# EAGLE design BEP2_rev1 seeed (EAGLE 6.5.0)
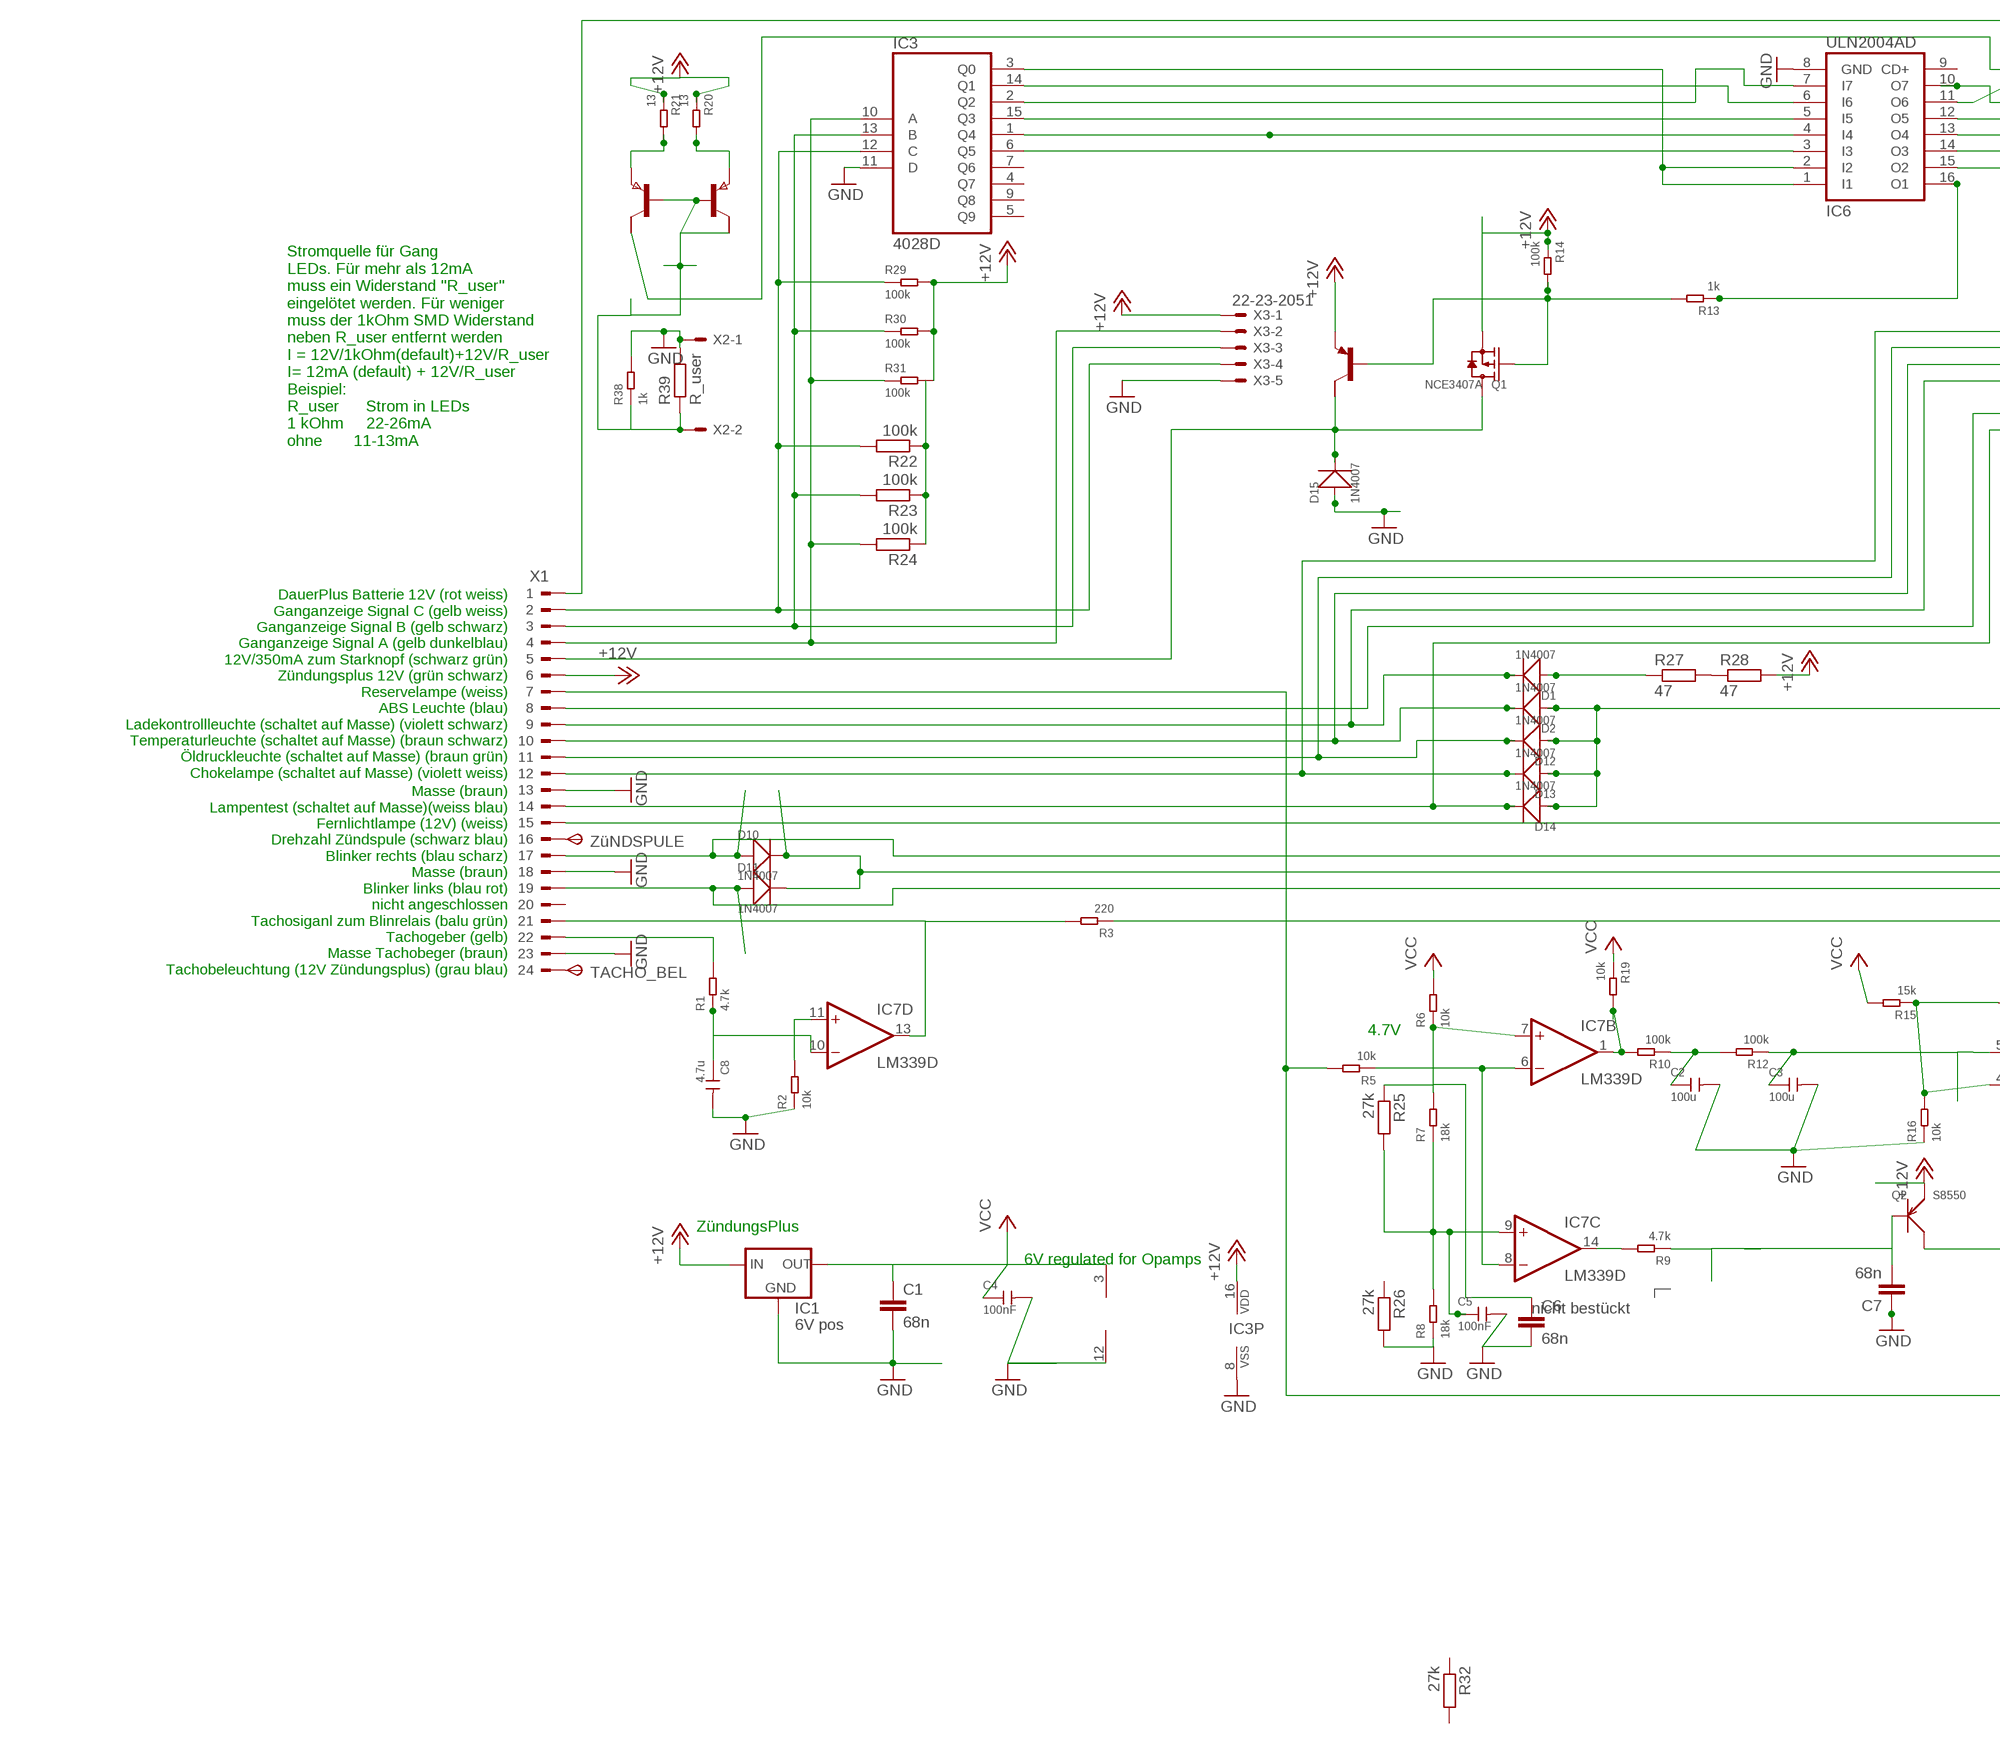
[diagram p0: schematic, sheet 1, part 1 of 2]
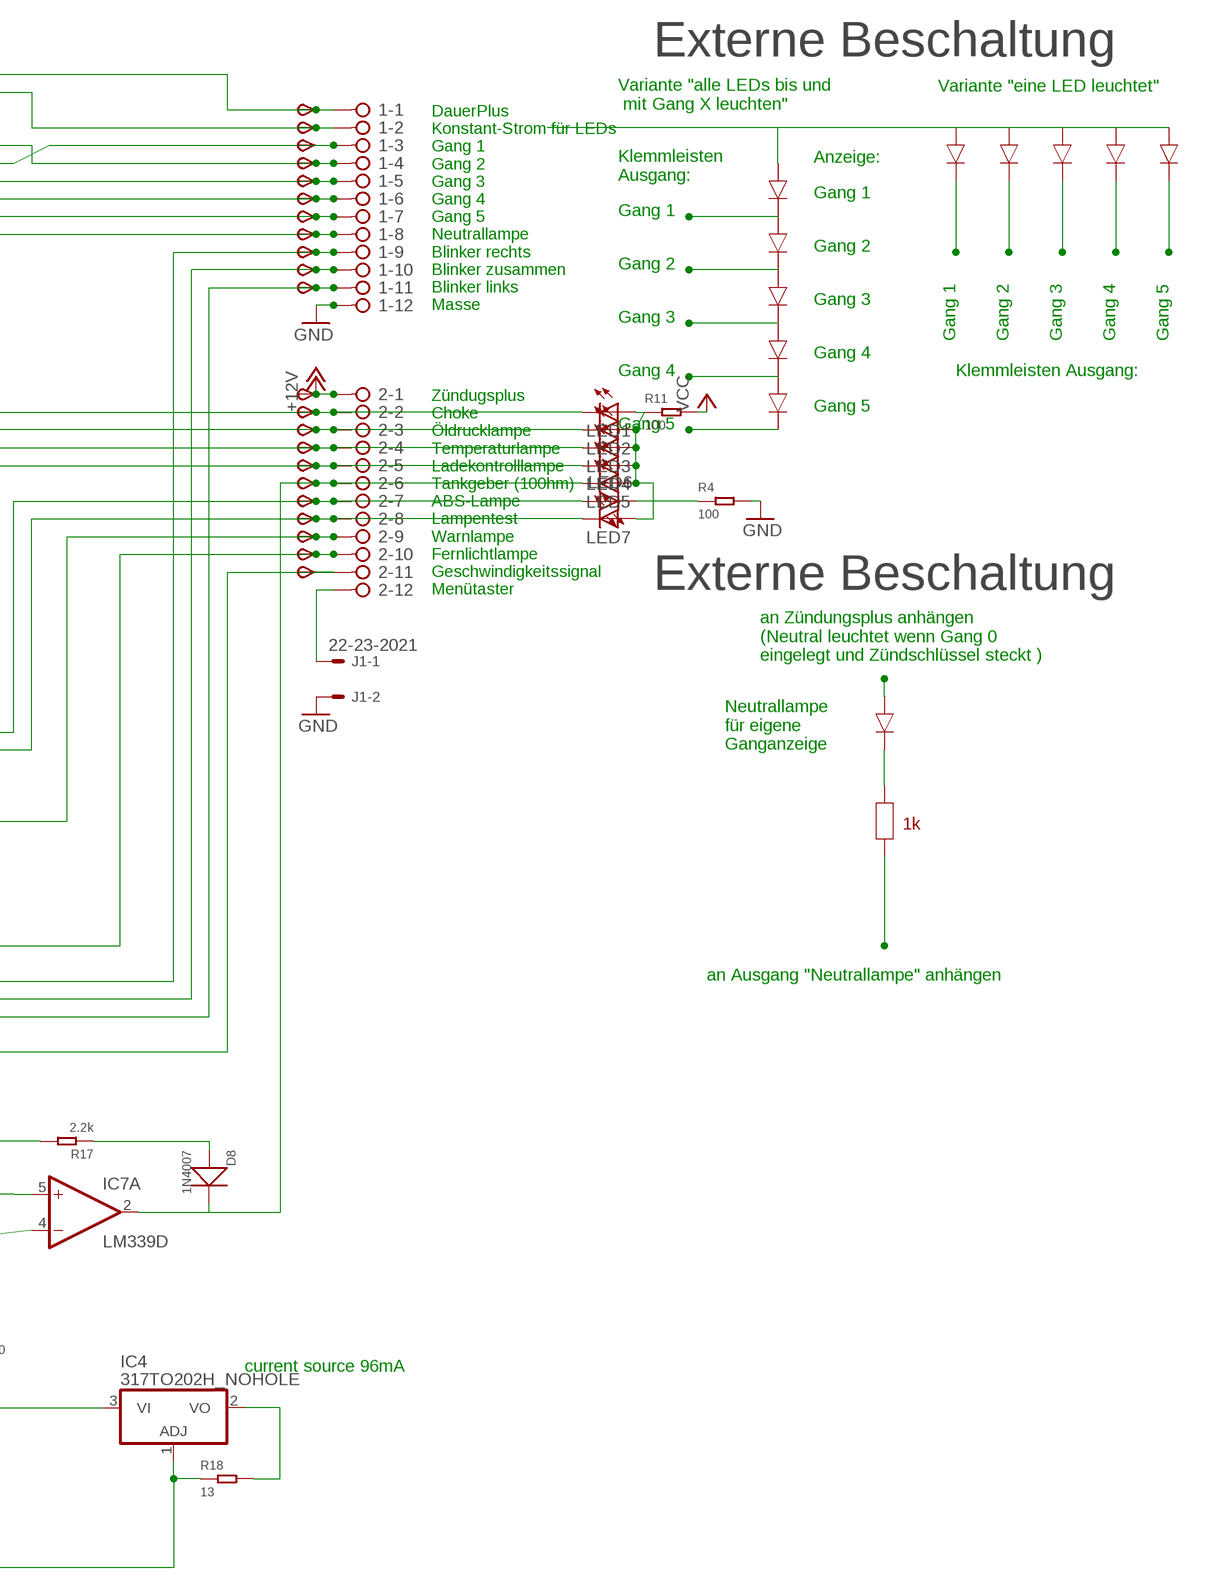
[diagram p1: schematic, sheet 1, part 2 of 2]

## Parts
1  2081-1132  [12-PIN]
2  2081-1132  [12-PIN]
C1  68n  C-EUC1206K  [C1206K]
C2  100u  CERAMIC-100UF-6.3V-20%-X5R(1206)  [C1206]
C3  100u  CERAMIC-100UF-6.3V-20%-X5R(1206)  [C1206]
C4  100nF  CERAMIC-100NF-50V-10%-X7R(0805)  [C0805]
C5  100nF  CERAMIC-100NF-50V-10%-X7R(0805)  [C0805]
C6  68n  C-EUC1206K  [C1206K]
C7  68n  C-EUC1206K  [C1206K]
C8  4.7u  CERAMIC-4.7UF-25V-10%-X5R(0805)  [C0805]
D1  1N4007  DIODE-GEN-PURPOSE-1KV-1A(DO-214AC)  [DO-214AC]
D2  1N4007  DIODE-GEN-PURPOSE-1KV-1A(DO-214AC)  [DO-214AC]
D8  1N4007  DIODE-GEN-PURPOSE-1KV-1A(DO-214AC)  [DO-214AC]
D10  1N4007  DIODE-GEN-PURPOSE-1KV-1A(DO-214AC)  [DO-214AC]
D11  1N4007  DIODE-GEN-PURPOSE-1KV-1A(DO-214AC)  [DO-214AC]
D12  1N4007  DIODE-GEN-PURPOSE-1KV-1A(DO-214AC)  [DO-214AC]
D13  1N4007  DIODE-GEN-PURPOSE-1KV-1A(DO-214AC)  [DO-214AC]
D14  1N4007  DIODE-GEN-PURPOSE-1KV-1A(DO-214AC)  [DO-214AC]
D15  1N4007  DIODE-GEN-PURPOSE-1KV-1A(DO-214AC)  [DO-214AC]
IC1  6V pos  78LXX  [78LXX]
IC3  4028D  [SO16]
IC4  317TO202H_NOHOLE  [TO220H_NOHOLE]
IC6  ULN2004AD  [SO16]
IC7  LM339D  [SO14]
J1  22-23-2021  [22-23-2021]
LED1  LEDLD260  [LD260]
LED2  LEDLD260  [LD260]
LED3  LEDLD260  [LD260]
LED4  LEDLD260  [LD260]
LED5  LEDLD260  [LD260]
LED6  LEDLD260  [LD260]
LED7  LEDLD260  [LD260]
Q1  NCE3407A  SMD-MOSFET-P-CH-VDC=30V-ID=4.3A-NCE3407A(SOT-23)  [SOT-23]
Q2  S8550  SMD-TRANSISTORS-PNP-25V-500MA-S8550(SOT-23)  [SOT-23]
Q3  BCP53T1  [SOT223]
R1  4.7k  SMD-RES-4.7K-5%-1/8W(0805)  [R0805]
R2  10k  SMD-RES-10K-1%-1/8W(0805)  [R0805]
R3  220  SMD-RES-220R-5%-1/8W(0805)  [R0805]
R4  100  SMD-RES-100R-5%-1/8W(0805)  [R0805]
R5  10k  SMD-RES-10K-1%-1/8W(0805)  [R0805]
R6  10k  SMD-RES-10K-1%-1/8W(0805)  [R0805]
R7  18k  SMD-RES-18K-5%-1/10W(0603)  [R0603]
R8  18k  SMD-RES-18K-5%-1/10W(0603)  [R0603]
R9  4.7k  SMD-RES-4.7K-5%-1/8W(0805)  [R0805]
R10  100k  SMD-RES-100K-1%-1/10W(0603)  [R0603]
R11  100  SMD-RES-100R-5%-1/8W(0805)  [R0805]
R12  100k  SMD-RES-100K-1%-1/10W(0603)  [R0603]
R13  1k  SMD-RES-1K-5%-1/8W(0805)  [R0805]
R14  100k  SMD-RES-100K-1%-1/10W(0603)  [R0603]
R15  15k  SMD-RES-15K-1%-1/10W(0603)  [R0603]
R16  10k  SMD-RES-10K-1%-1/8W(0805)  [R0805]
R17  2.2k  SMD-RES-2.2K-5%-1/8W(0805)  [R0805]
R18  13  SMD-RES-13R-5%-1/4W(1206)  [R1206]
R19  10k  SMD-RES-10K-1%-1/8W(0805)  [R0805]
R20  13  SMD-RES-13R-5%-1/4W(1206)  [R1206]
R21  13  SMD-RES-13R-5%-1/4W(1206)  [R1206]
R22  100k  R-EU_R0805  [R0805]
R23  100k  R-EU_R0805  [R0805]
R24  100k  R-EU_R0805  [R0805]
R25  27k  R-EU_R0805  [R0805]
R26  27k  R-EU_R0805  [R0805]
R27  47  R-EU_V235/17_1MM  [V235/17_1MM]
R28  47  R-EU_V235/17_1MM  [V235/17_1MM]
R29  100k  SMD-RES-100K-1%-1/10W(0603)  [R0603]
R30  100k  SMD-RES-100K-1%-1/10W(0603)  [R0603]
R31  100k  SMD-RES-100K-1%-1/10W(0603)  [R0603]
R32  27k  R-EU_R0805  [R0805]
R38  1k  SMD-RES-1K-5%-1/8W(0805)  [R0805]
R39  R_user  R-EU_R0805  [R0805]
T1  PNP2SM8  [SM8]
TACHO_BEL  TPSP1_1MM  [P1_1.0MM]
TP1  TPSB1.8  [B1.8]
TP2  TPSB1.8  [B1.8]
TP3  TPSB1.8  [B1.8]
TP4  TPSB1.8  [B1.8]
TP5  TPSB1.8  [B1.8]
TP6  TPSB1.8  [B1.8]
TP7  TPSB1.8  [B1.8]
TP8  TPSB1.8  [B1.8]
TP9  TPSB1.8  [B1.8]
TP10  TPSB1.8  [B1.8]
TP11  TPSB1.8  [B1.8]
TP12  TPSB1.8  [B1.8]
TP16  TPSB1.8  [B1.8]
TP17  TPSB1.8  [B1.8]
TP18  TPSB1.8  [B1.8]
TP19  TPSB1.8  [B1.8]
TP21  TPSB1.8  [B1.8]
TP22  TPSB1.8  [B1.8]
TP23  TPSB1.8  [B1.8]
TP24  TPSB1,27  [B1,27]
TP25  TPSB1.8  [B1.8]
TP26  TPSB1.8  [B1.8]
X1  CON_BMW  [24-PIN]
X2  22-23-2021  [22-23-2021]
X3  22-23-2051  [22-23-2051]
ZüNDSPULE  TPSP1_1MM  [P1_1.0MM]

## Nets
+12V: 2.1 IC1.IN IC3.16(VDD) Q1.2(S) Q2.2(E) Q3.3(E) R14.1 R20.1 R21.1 R28.2 R29.2 R30.2 R31.2 TP12.TP(PP) X1.6 X3.1
GND: 1.12 C1.2 C2.2 C3.2 C4.2 C5.2 C6.2 C7.1 C8.2 D15.1(+) IC1.GND IC3.8(VSS) IC3.11(D) IC6.8(GND) IC7.12(P:GND) J1.2 R2.1 R4.2 R8.1 R16.1 R26.2 R38.2 R39.2 X1.13 X1.18 X1.23 X2.1 X3.5
N$1: 2.9 D2.1(+) D12.1(+) D13.1(+) D14.1(+) TP24.TP(PP)
N$2: IC3.10(A) R24.2 R31.1 X1.4 X3.2
N$3: IC3.13(B) R23.2 R30.1 X1.3 X3.3
N$4: 2.7 LED6.A TP22.TP(PP) X1.8
N$5: R21.2 T1.1(B:E)
N$6: IC6.16(O1) R13.1
N$7: IC7.11(D:+IN) R2.2
N$8: R27.2 R28.1
N$9: R20.2 T1.3(A:E)
N$11: D15.2(-) Q1.3(D) Q3.2(C) X1.5
N$12: 2.2 D13.2(-) LED1.K(C) TP16.TP(PP) X1.12
N$13: 2.3 D12.2(-) LED2.K(C) TP17.TP(PP) X1.11
N$14: 2.4 D2.2(-) LED3.K(C) TP18.TP(PP) X1.10
N$15: IC4.1(ADJ) R5.2 R18.1 X1.7
N$16: IC7.6(B:-IN) IC7.8(C:-IN) R5.1
N$17: IC3.12(C) R22.2 R29.1 X1.2 X3.4
N$18: IC3.15(Q3) IC6.5(I5)
N$19: 2.8 D14.2(-) LED7.K(C) TP23.TP(PP) X1.14
N$20: 1.9 D10.1(+) TP9.TP(PP) X1.17
N$21: 1.11 D11.1(+) TP11.TP(PP) X1.19
N$22: 1.10 D10.2(-) D11.2(-) TP10.TP(PP)
N$23: R1.2 X1.22
N$24: C8.1 IC7.10(D:-IN) R1.1
N$25: 1.6 IC6.13(O4) TP6.TP(PP)
N$26: 1.7 IC6.14(O3) TP7.TP(PP)
N$27: 2.11 R3.1 TP26.TP(PP)
N$28: 2.12 J1.1
N$29: IC4.2(VO) R18.2
N$30: C5.1 IC7.9(C:+IN) R7.1 R8.2 R25.2
N$31: IC7.14(C:OUT) R9.2
N$34: LED6.K(C) R4.1
N$35: IC4.3(VI) Q2.3(C)
N$36: C7.2 Q2.1(B) R9.1
N$37: IC3.2(Q2) IC6.7(I7)
N$38: 1.3 IC6.11(O6) TP3.TP(PP)
N$39: 1.5 IC6.12(O5) TP5.TP(PP)
N$41: LED1.A LED2.A LED3.A LED4.A LED5.A LED7.A R11.1
N$42: X1.16 ZüNDSPULE.TP(PP)
N$43: Q1.1(G) Q3.1(B) R13.2 R14.2
N$44: IC3.3(Q0) IC6.1(I1) IC6.2(I2)
N$45: C2.1 R10.1 R12.2
N$46: C3.1 IC7.5(A:+IN) R12.1
N$47: IC7.4(A:-IN) R15.1 R16.2 R17.2
N$48: IC7.13(D:OUT) R3.2 X1.21
N$49: D8.1(+) R17.1
N$50: IC3.1(Q4) IC6.4(I4)
N$51: R22.1 R23.1 R24.1
N$52: 1.8 IC6.15(O2) TP8.TP(PP)
N$53: 2.10 TP25.TP(PP) X1.15
N$54: D1.1(+) R27.1
N$55: 2.5 D1.2(-) LED4.K(C) TP19.TP(PP) X1.9
N$56: IC3.14(Q1) IC6.6(I6)
N$57: R38.1 R39.1 T1.2(B:B) T1.4(A:B) T1.6(A:C1) X2.2
N$58: TACHO_BEL.TP(PP) X1.24
N$59: 1.2 T1.8(B:C1) TP2.TP(PP)
N$60: 2.6 D8.2(-) IC7.2(A:OUT) LED5.K(C) TP21.TP(PP)
N$61: IC3.6(Q5) IC6.3(I3)
N$67: 1.4 IC6.10(O7) TP4.TP(PP)
N$69: 1.1 TP1.TP(PP) X1.1
N$83: C6.1 IC7.7(B:+IN) R6.1 R7.2 R25.1
N$580: IC7.1(B:OUT) R10.2 R19.2
VCC: C1.1 C4.1 IC1.OUT IC7.3(P:V+) R6.2 R11.2 R15.2 R19.1
Unconnected: IC3.4(Q7) IC3.5(Q9) IC3.7(Q6) IC3.9(Q8) IC6.9(CD+) Q3.4(C/) R26.1 R32.1 R32.2 T1.5(A:C) T1.7(B:C) X1.20

## Notes on the sheet
- Externe Beschaltung
- Variante "eine LED leuchtet"
- Variante "alle LEDs bis und
   mit Gang X leuchten"
- Anzeige:
- Klemmleisten
  Ausgang:
- Gang 1
- DauerPlus
  Konstant-Strom für LEDs
  Gang 1
  Gang 2
  Gang 3
  Gang 4
  Gang 5
  Neutrallampe
  Blinker rechts
  Blinker zusammen
  Blinker links
  Masse
- Gang 1
- Gang 2
- Gang 2
- Gang 3
- Gang 3
- Gang 1 | Gang 2 | Gang 3 | Gang 4 | Gang 5
- Gang 4
- Gang 4 | Klemmleisten Ausgang:
- Gang 5
- Gang 5
- Zündugsplus
  Choke
  Öldrucklampe
  Temperaturlampe
  Ladekontrolllampe
  Tankgeber (100hm)
  ABS-Lampe
  Lampentest
  Warnlampe
  Fernlichtlampe
  Geschwindigkeitssignal
  Menütaster
- Stromquelle für Gang
  LEDs. Für mehr als 12mA
  muss ein Widerstand "R_user"
  eingelötet werden. Für weniger
  muss der 1kOhm SMD Widerstand
  neben R_user entfernt werden
  I = 12V/1kOhm(default)+12V/R_user
  I= 12mA (default) + 12V/R_user
  Beispiel:
  R_user      Strom in LEDs
  1 kOhm     22-26mA
  ohne       11-13mA
- Externe Beschaltung
- an Zündungsplus anhängen
  (Neutral leuchtet wenn Gang 0
  eingelegt und Zündschlüssel steckt )
- Neutrallampe
  für eigene
  Ganganzeige
- DauerPlus Batterie 12V (rot weiss)
  Ganganzeige Signal C (gelb weiss)
  Ganganzeige Signal B (gelb schwarz)
  Ganganzeige Signal A (gelb dunkelblau)
  12V/350mA zum Starknopf (schwarz grün)
  Zündungsplus 12V (grün schwarz)
  Reservelampe (weiss)
  ABS Leuchte (blau)
  Ladekontrollleuchte (schaltet auf Masse) (violett schwarz)
  Temperaturleuchte (schaltet auf Masse) (braun schwarz)
  Öldruckleuchte (schaltet auf Masse) (braun grün)
  Chokelampe (schaltet auf Masse) (violett weiss)
- 1k
- an Ausgang "Neutrallampe" anhängen
- Masse (braun)
  Lampentest (schaltet auf Masse)(weiss blau)
  Fernlichtlampe (12V) (weiss)
  Drehzahl Zündspule (schwarz blau)
  Blinker rechts (blau scharz)
  Masse (braun)
  Blinker links (blau rot)
  nicht angeschlossen
  Tachosiganl zum Blinrelais (balu grün)
  Tachogeber (gelb)
  Masse Tachobeger (braun)
  Tachobeleuchtung (12V Zündungsplus) (grau blau)
- 4.7V
- current source 96mA
- ZündungsPlus
- 6V regulated for Opamps
- nicht bestückt

## Library data of the parts
1 2 = con WAGO BMW:2081-1132: WAGO SREW CLAMP
C1 C6 C7 = rcl:C-EU: CAPACITOR, European symbol
C2 C3 = Seeed-Capacitor-2016:CERAMIC-100UF-6.3V-20%-X5R(1206): 302010183; MPN: GRM31CR60J107ME39L; VALUE: 100uf
C4 C5 = Seeed-Capacitor-2016:CERAMIC-100NF-50V-10%-X7R(0805): 302010165; MPN: CC0805KRX7R9BB104; VALUE: 100nf
C8 = Seeed-Capacitor-2016:CERAMIC-4.7UF-25V-10%-X5R(0805): 302010146; MPN: CC0805KKX5R8BB475; VALUE: 4.7uf
D1 D2 D8 D10-D15 = Seeed-Diode-2016:DIODE-GEN-PURPOSE-1KV-1A(DO-214AC): 304010013; MPN: 1N4007
IC1 = v-reg:78LXX: VOLTAGE REGULATOR
IC3 = 40xx:4028: BCD to decimal DECODER
IC4 = linear_BMW:*317: Positive VOLTAGE REGULATOR
IC6 = uln-udn:ULN2004A: DRIVER ARRAY
IC7 = linear:LM339: Low Power Low Offset Voltage Quad Comparators with open collector; LM139/LM239/LM339/LM2901/LM3302
J1 = con_Molex_BMW:22-23-2021: .100" (2.54mm) Center Header - 2 Pin; MF: MOLEX; MPN: 22-23-2021; OC_FARNELL: 1462926; OC_NEWARK: 25C3832
LED1-LED7 = led:LED: LED OSRAM: - CHIPLED LG R971, LG N971, LY N971, LG Q971, LY Q971, LO R971, LY R971 LH N974, LH R974 LS Q976, LO Q976, LY Q976 LO Q996 - Hyper CHIPLED LW Q18S LB Q993, LB Q99A, LB R99A - SideLED LS A670, LO A670, LY A670, LG A670, LP A670 LB A673, LV A673, LT A673, LW A673 LH A674 LY A675 LS A676, LA A676, LO A676, LY A676, LW A676 LS A679, LY A679, LG A679 - Hyper Micro SIDELED® LS Y876, LA Y876, LO Y876, LY Y876 LT Y87S - SmartLED LW L88C, LW L88S LB L89C, LB L89S, LG L890 LS L89K, LO L89K, LY L89K LS L896, LA L896, LO L896, LY L896 - TOPLED LS T670, LO T670, LY T670, LG T670, LP T670 LSG T670, LSP T670, LSY T670, LOP T670, LYG T670 LG T671, LOG T671, LSG T671 LB T673, LV T673, LT T673, LW T673 LH T674 LS T676, LA T676, LO T676, LY T676, LB T676, LH T676, LSB T676, LW T676 LB T67C, LV T67C, LT T67C, LS T67K, LO T67K, LY T67K, LW E67C LS E67B, LA E67B, LO E67B, LY E67B, LB E67C, LV E67C, LT E67C LW T67C LS T679, LY T679, LG T679 LS T770, LO T770, LY T770, LG T770, LP T770 LB T773, LV T773, LT T773, LW T773 LH T774 LS E675, LA E675, LY E675, LS T675 LS T776, LA T776, LO T776, LY T776, LB T776 LHGB T686 LT T68C, LB T68C - Hyper Mini TOPLED® LB M676 - Mini TOPLED Santana® LG M470 LS M47K, LO M47K, LY M47K Source: http://www.osram.convergy.de LUXEON: - LUMILED® LXK2-PW12-R00, LXK2-PW12-S00, LXK2-PW14-U00, LXK2-PW14-V00 LXK2-PM12-R00, LXK2-PM12-S00, LXK2-PM14-U00 LXK2-PE12-Q00, LXK2-PE12-R00, LXK2-PE12-S00, LXK2-PE14-T00, LXK2-PE14-U00 LXK2-PB12-K00, LXK2-PB12-L00, LXK2-PB12-M00, LXK2-PB14-N00, LXK2-PB14-P00, LXK2-PB14-Q00 LXK2-PR12-L00, LXK2-PR12-M00, LXK2-PR14-Q00, LXK2-PR14-R00 LXK2-PD12-Q00, LXK2-PD12-R00, LXK2-PD12-S00 LXK2-PH12-R00, LXK2-PH12-S00 LXK2-PL12-P00, LXK2-PL12-Q00, LXK2-PL12-R00 Source: www.luxeon.com KINGBRIGHT: KA-3528ASYC Source: www.kingbright.com
Q1 = Seeed-Transistor-2016:SMD-MOSFET-P-CH-VDC=30V-ID=4.3A-NCE3407A(SOT-23): 305030010; MPN: NCE3407A
Q2 = Seeed-Transistor-2016:SMD-TRANSISTORS-PNP-25V-500MA-S8550(SOT-23): 305020006; MPN: S8550
Q3 = BCP53_:BCP53*
R1 R9 = Seeed-Resistor-2016:SMD-RES-4.7K-5%-1/8W(0805): 301010306; MPN: RC0805JR-074K7L; VALUE: 4.7K
R2 R5 R6 R16 R19 = Seeed-Resistor-2016:SMD-RES-10K-1%-1/8W(0805): 301010361; MPN: RC0805FR-0710KL; VALUE: 10K
R3 = Seeed-Resistor-2016:SMD-RES-220R-5%-1/8W(0805): 301010315; MPN: RC0805JR-07220RL; VALUE: 220R
R4 R11 = Seeed-Resistor-2016:SMD-RES-100R-5%-1/8W(0805): 301010319; MPN: RC0805JR-07100RL; VALUE: 100R
R7 R8 = Seeed-Resistor-2016:SMD-RES-18K-5%-1/10W(0603): 301010104; MPN: RC0603JR-0718KL; VALUE: 18K 1/10W
R10 R12 R14 R29-R31 = Seeed-Resistor-2016:SMD-RES-100K-1%-1/10W(0603): 301010196; MPN: RC0603FR-07100KL; VALUE: 100K
R13 R38 = Seeed-Resistor-2016:SMD-RES-1K-5%-1/8W(0805): 301010311; MPN: RC0805JR-071KL; VALUE: 1K
R15 = Seeed-Resistor-2016:SMD-RES-15K-1%-1/10W(0603): 301010241; MPN: RC0603FR-0715KL; VALUE: 15K 1/10W
R17 = Seeed-Resistor-2016:SMD-RES-2.2K-5%-1/8W(0805): 301010333; MPN: RC0805JR-072K2L; VALUE: 2.2K
R18 R20 R21 = Seeed-Resistor-2016:SMD-RES-13R-5%-1/4W(1206): 301010405; MPN: RC1206JR-0713RL; VALUE: 13R
R22-R28 R32 R39 = rcl:R-EU_: RESISTOR, European symbol
T1 = PNP2SM8:PNP2SM8; OC_FARNELL: unknown; OC_NEWARK: unknown
TACHO_BEL TP1-TP12 TP16-TP19 TP21-TP26 ZüNDSPULE = testpin_BMW:TPS: TEST PIN
X1 = con_BMW:CON_BMW: BMW CONNECTOR
X2 = con-molex:22-23-2021: .100" (2.54mm) Center Header - 2 Pin; MF: MOLEX; MPN: 22-23-2021; OC_FARNELL: 1462926; OC_NEWARK: 25C3832
X3 = con_Molex_BMW:22-23-2051: .100" (2.54mm) Center Header - 5 Pin; MF: MOLEX; MPN: 22-23-2051; OC_FARNELL: 1462952; OC_NEWARK: 38C9178

## Board
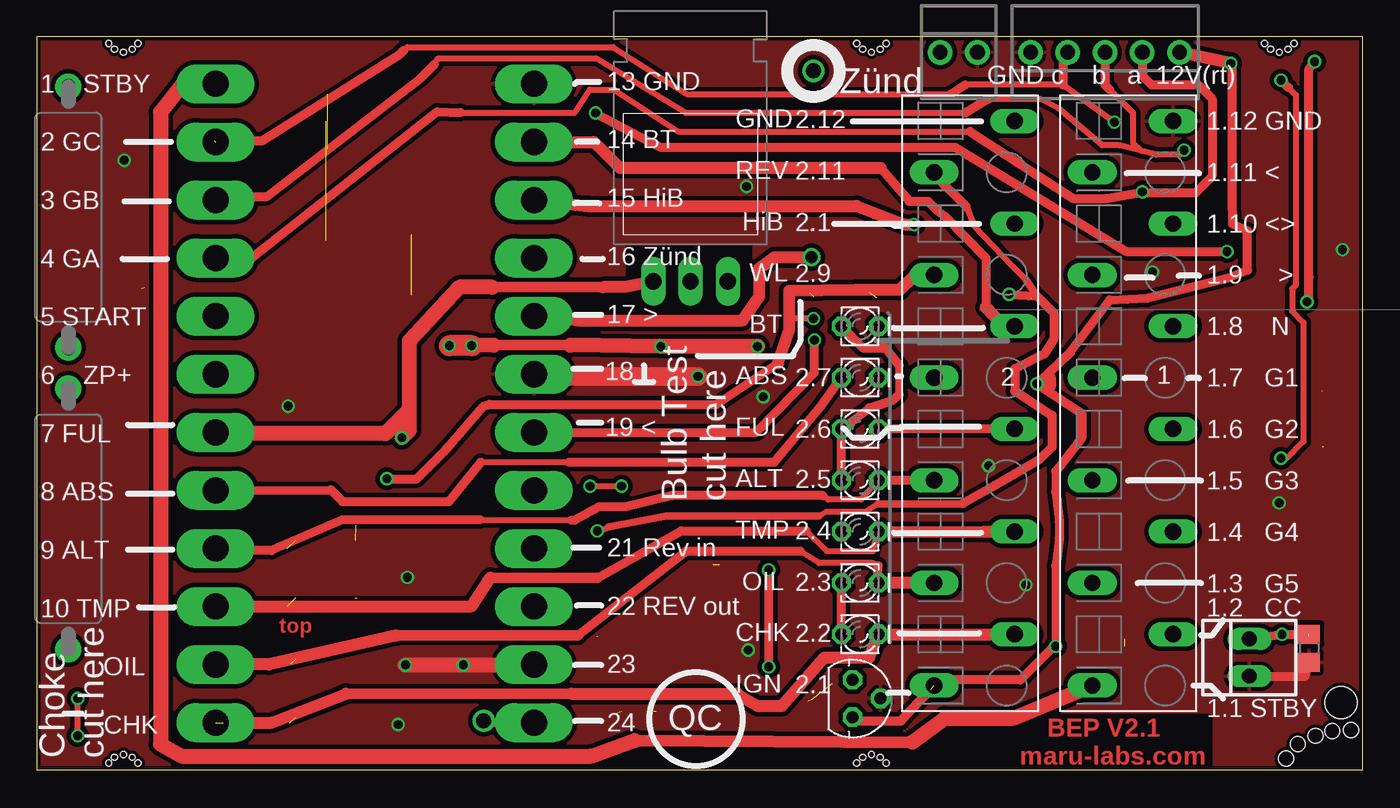
[diagram p2: board, top side]
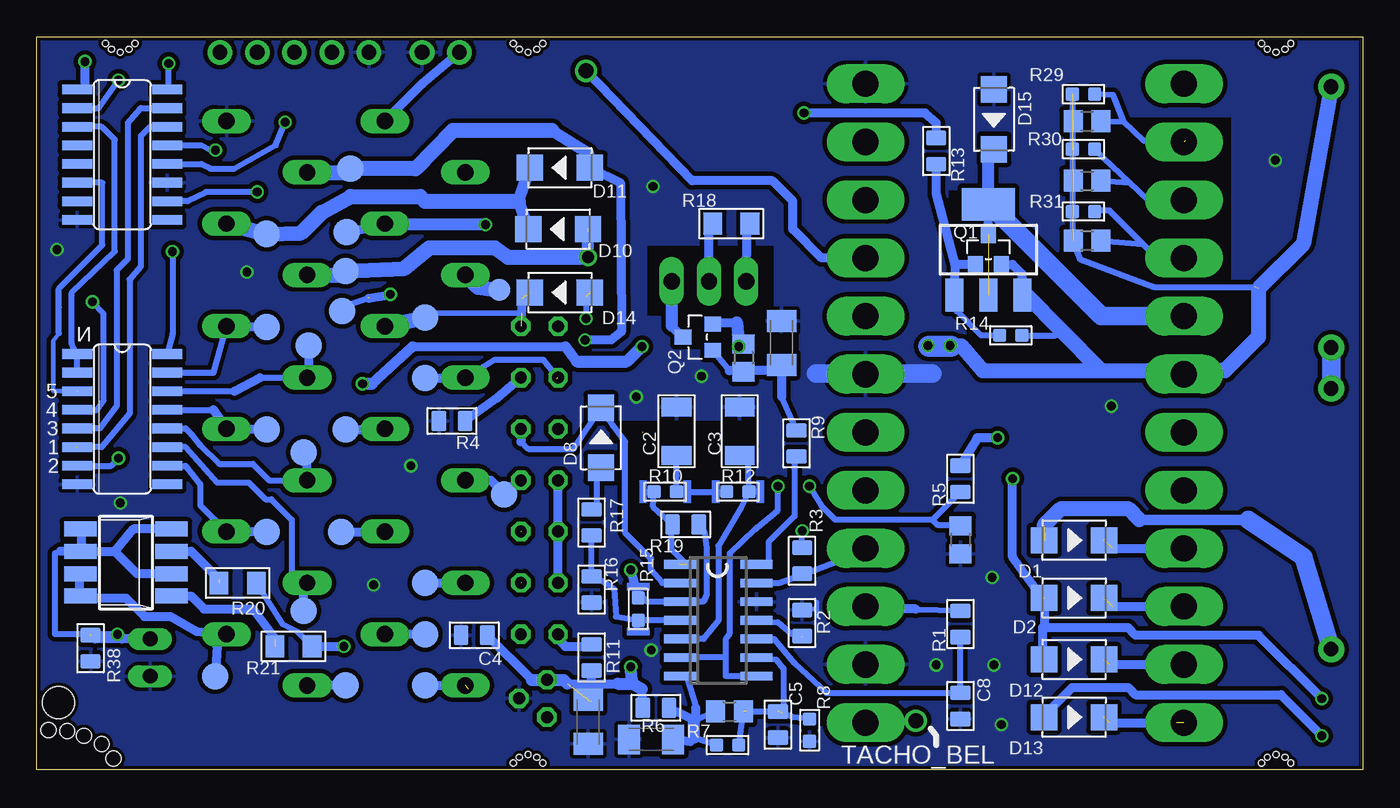
[diagram p3: board, bottom side, seen from below]

Size 90.41 x 50 mm. Coordinates in mm from the lower left corner, seen from the top.
Outline: 0,0 90.41,0 90.41,50 0,50 0,0
Copper layers (1*16): Top 0.035mm / dielectric 1.5mm / Bottom 0.035mm
Design rules "SeeedStudio_2layer_DRU_no_angle_20140221 *": minimum track width 6mil, minimum drill 12mil, track to track 12mil, track to pad 12mil, pad to pad 6mil, via to via 6mil, smd to smd 0mil, copper to edge 10mil, drill to drill 10mil, minimum pad ring 10mil, minimum via ring 6mil, stop-mask expansion 2mil, vias tented up to drill 100mil, thermal gap 10mil
Holes 1.02 mm at 89.6,2.71 88.33,2.64 87.19,2.33 85.98,1.75 85.17,0.77
Holes 2.18 mm at 88.91,4.6
Holes 0.4 mm at 56.91,1.06 56.31,0.86 55.91,0.46 57.51,0.86 57.91,0.46 5.91,1.06 5.31,0.86 4.91,0.46 6.51,0.86 6.91,0.46 5.91,48.94 6.51,49.14 6.91,49.54 5.31,49.14 4.91,49.54 56.91,48.94 57.51,49.14 57.91,49.54 56.31,49.14 55.91,49.54 84.71,48.94 85.31,49.14 85.71,49.54 84.11,49.14 83.71,49.54
tRestrict: area 40.2,31 to 48.8,35.7
bRestrict: area 9,29.3 to 15.7,44.5; area 40.2,31 to 48.8,35.7; area 41.3,22.3 to 51.3,23.8; area 38.5,28.6 to 41.3,29.8; area 48.1,0.9 to 49.1,3; area 40.8,29.6 to 42,31.2; area 23.8,35.3 to 28.2,39.5; area 45,28.7 to 45.7,30.4

### Footprints (pad centres in the part's own frame; a part is rotated, then mirrored left to right if it is on the bottom)
12-PIN = drill 1.118 long: 1 19.25,-2.45; 2 15.75,3.05; 3 12.25,-2.45; 4 8.75,3.05; 5 5.25,-2.45; 6 1.75,3.05; 7 -1.75,-2.45; 8 -5.25,3.05; 9 -8.75,-2.45; 10 -12.25,3.05; 11 -15.75,-2.45; 12 -19.25,3.05
C1206K = smd 1.5 x 2: 1 -1.5,0; 2 1.5,0
C1206 = smd 1.27 x 2.032: 1 -1.651,0; 2 1.651,0
C0805 = smd 1.397 x 1.016: 1 0,0.889; 2 0,-0.889
DO-214AC = smd 1.8 x 1.77: 1 -2.042,0; 2 2.042,0
78LXX = drill 0.813 octagon: GND 0,1.905; IN 1.27,0; OUT -1.27,0
SO16 = smd 0.66 x 2.032: 1 -4.445,-3.073; 2 -3.175,-3.073; 3 -1.905,-3.073; 4 -0.635,-3.073; 5 0.635,-3.073; 6 1.905,-3.073; 7 3.175,-3.073; 8 4.445,-3.073; 9 4.445,3.073; 10 3.175,3.073; 11 1.905,3.073; 12 0.635,3.073; 13 -0.635,3.073; 14 -1.905,3.073; 15 -3.175,3.073; 16 -4.445,3.073
TO220H_NOHOLE = drill 1.118 long: 1 -2.54,-10.16; 2 0,-10.16; 3 2.54,-10.16
SO14 = smd 0.6 x 2.2: 1 -3.81,-2.6; 2 -2.54,-2.6; 3 -1.27,-2.6; 4 0,-2.6; 5 1.27,-2.6; 6 2.54,-2.6; 7 3.81,-2.6; 8 3.81,2.6; 9 2.54,2.6; 10 1.27,2.6; 11 0,2.6; 12 -1.27,2.6; 13 -2.54,2.6; 14 -3.81,2.6
22-23-2021 = drill 1 pad 1.676: 1 -1.27,0; 2 1.27,0
LD260 = drill 0.813 octagon: A -1.27,0; K 1.27,0
SOT-23 = smd 1.016 x 1.143: 1 -0.889,-1.016; 2 0.889,-1.016; 3 0,1.016
SOT223 = smd 1.219 x 2.235: 1 -2.311,-3.099; 2 0,-3.099; 3 2.311,-3.099 | smd 3.6 x 2.2: 4 0,3.099
R0805 = smd 1.397 x 1.016: 1 0,0.889; 2 0,-0.889
R0603 = smd 0.889 x 0.889: 1 0,0.762; 2 0,-0.762
R1206 = smd 1.27 x 1.524: 1 -1.27,0; 2 1.27,0
R0805' = smd 1.3 x 1.5: 1 -0.95,0; 2 0.95,0
V235/17_1MM = drill 1 pad 1.778: 1 -8.89,0; 2 8.89,0
SM8 = smd 1.016 x 2.235: 1 -2.286,-3.099; 2 -0.762,-3.099; 3 0.762,-3.099; 4 2.286,-3.099; 5 2.286,3.099; 6 0.762,3.099; 7 -0.762,3.099; 8 -2.286,3.099
P1_1.0MM = drill 1.016: TP 0,0
B1.8 = smd 1.8 x 1.8: TP 0,0
B1,27 = smd 1.5 x 1.5: TP 0,0
24-PIN = drill 1.778 long: 1 -21.78,-10.85; 2 -17.82,-10.85; 3 -13.86,-10.85; 4 -9.9,-10.85; 5 -5.94,-10.85; 6 -1.98,-10.85; 7 1.98,-10.85; 8 5.94,-10.85; 9 9.9,-10.85; 10 13.86,-10.85; 11 17.82,-10.85; 12 21.78,-10.85; 13 -21.78,10.85; 14 -17.82,10.85; 15 -13.86,10.85; 16 -9.9,10.85; 17 -5.94,10.85; 18 -1.98,10.85; 19 1.98,10.85; 20 5.94,10.85; 21 9.9,10.85; 22 13.86,10.85; 23 17.82,10.85; 24 21.78,10.85
22-23-2021' = drill 1 long: 1 -1.27,0; 2 1.27,0
22-23-2051 = drill 1 pad 1.676: 1 -5.08,0; 2 -2.54,0; 3 0,0; 4 2.54,0; 5 5.08,0

### Placement (x,y rotation side)
1  74.42,25 270 top
2  63.63,25 270 top
C1  52.81,3.27 270 bottom
C2  46.8,23.09 90 bottom
C3  42.48,23.09 90 bottom
C4  60.58,9.18 270 bottom
C5  39.88,3.09 0 bottom
C6  48.51,2.07 180 bottom
C7  39.62,29.12 270 bottom
C8  27.43,4.36 0 bottom
D1  19.68,15.66 0 bottom
D2  19.68,11.72 0 bottom
D8  51.94,22.65 90 bottom
D10  54.86,36.87 180 bottom
D11  54.74,41.06 180 bottom
D12  19.68,7.53 0 bottom
D13  19.68,3.6 0 bottom
D14  54.74,32.55 180 bottom
D15  25.15,44.36 270 bottom
IC1  55.63,4.87 270 top
IC3  84.58,41.95 270 bottom
IC4  44.58,43.47 0 top
IC6  84.58,23.92 270 bottom
IC7  43.94,10.2 270 bottom
J1  62.87,48.94 0 top
LED1  56.13,9.25 0 top
LED2  56.13,12.75 0 top
LED3  56.13,16.25 0 top
LED4  56.13,19.75 0 top
LED5  56.13,23.25 0 top
LED6  56.13,26.75 0 top
LED7  56.13,30.25 0 top
Q1  25.53,35.47 0 bottom
Q2  45.34,29.5 90 bottom
Q3  25.53,35.47 0 bottom
R1  27.43,9.95 180 bottom
R2  38.23,10.01 0 bottom
R3  38.23,14.26 0 bottom
R4  62.1,23.79 270 bottom
R5  27.43,19.85 180 bottom
R6  48.2,4.23 270 bottom
R7  43.31,1.69 270 bottom
R8  37.72,2.71 180 bottom
R9  38.61,22.27 0 bottom
R10  47.56,18.96 270 bottom
R11  52.58,7.66 0 bottom
R12  42.61,18.96 270 bottom
R13  29.08,42.2 0 bottom
R14  24,29.63 270 bottom
R15  49.4,10.96 180 bottom
R16  52.58,12.3 180 bottom
R17  52.58,16.87 0 bottom
R18  43.05,37.25 180 bottom
R19  46.16,16.74 270 bottom
R20  76.71,12.74 180 bottom
R21  72.9,8.42 180 bottom
R22  100k  [R0805']  18.8,44.24 0 bottom
R23  100k  [R0805']  18.8,40.17 0 bottom
R24  100k  [R0805']  18.8,36.11 0 bottom
R25  27k  [R0805']  43.18,3.98 0 bottom
R26  27k  [R0805']  27.43,15.69 270 bottom
R27  2.16,17.12 90 top
R28  2.16,37.7 90 top
R29  19.05,46.08 270 bottom
R30  19.05,42.33 270 bottom
R31  19.05,38.08 270 bottom
R32  27k  [R0805']  42.21,28.1 270 bottom
R38  86.74,8.29 0 bottom
R39  R_user  [R0805']  86.74,8.29 270 top
T1  84.33,14.14 90 bottom
TACHO_BEL  30.48,3.34 0 bottom
TP1  69.34,5.76 0 bottom
TP2  78.23,6.39 0 bottom
TP3  72.2,10.84 0 bottom
TP4  74.74,16.23 0 bottom
TP5  72.2,21.63 0 bottom
TP6  74.74,23.22 0 bottom
TP7  71.88,28.93 0 bottom
TP8  74.74,30.2 0 bottom
TP9  69.34,34.01 0 bottom
TP10  74.74,36.55 0 bottom
TP11  69.02,41 0 bottom
TP12  63.94,5.76 0 bottom
TP16  63.94,9.25 0 bottom
TP17  63.94,12.74 0 bottom
TP18  69.66,16.23 0 bottom
TP19  58.55,18.77 0 bottom
TP21  69.34,23.22 0 bottom
TP22  63.94,26.71 0 bottom
TP23  63.94,30.84 0 bottom
TP24  58.86,32.74 0 bottom
TP25  69.28,36.68 0 bottom
TP26  69.6,31.28 0 bottom
X1  23.05,25 270 top
X2  22-23-2021  [22-23-2021']  82.68,7.66 90 top
X3  72.83,48.94 180 top
ZüNDSPULE  52.96,47.66 0 bottom

### Tracks (layer width: path | path; a pad name or v marks a point on that pad's centre or on a via)
+12V  (via drill 0.6)  (3 unrouted)
  Top 0.406: IC1.IN 55.88,3.6 56.13,3.34 | 60.96,5.5 60.93,5.5
  Top 0.61: v81.41,48.17 81.51,48.07 81.51,39.03 81.53,37.23 82.55,36.74 82.55,34.08 81.28,33.57 75.69,32.17 73.15,32.04 70.48,28.49 v68.2,26.33 71.25,24.3 71.25,22.65 69.47,20.36 69.47,18.96 69.72,16.93 69.72,15.79 69.47,13.88 v69.47,8.42 69.34,8.42 67.06,6.14 61.56,6.14 2.1 | 56.13,3.34 58.93,3.34 60.96,5.5 | v42.55,28.87 41.27,28.87
  Top 0.711: 36.39,28.97 31.18,28.97
  Top 0.813: v81.41,48.17 X3.1
  Top 1.016: v49.15,28.87 v42.55,28.87 36.39,28.97 | 31.18,28.97 v29.65,28.93
  Top 1.422: v29.65,28.93 v28.13,28.93
  Bottom 0.406: IC3.16 81.41,46.4 v81.41,48.17 | R29.2 R31.2 19.81,36.11 19.3,34.84 14.22,32.93 7.37,32.93 | R14.1 20.95,29.63 20.59,29.99 | R20.1 73.66,9.95 72.64,9.44 R21.1
  Bottom 0.61: 2.1 TP12.TP 64.33,6.14 | 69.34,8.42 v69.47,8.42 R21.1 | Q2.2 44.2,30.52 42.67,30.52 | 64.77,28.87 54.36,28.87 | Q1.2 23.88,34.46 23.24,33.82 23.24,32.4 Q3.3
  Bottom 0.711: 64.77,28.87 67.56,26.33 | 54.36,28.87 53.59,27.85
  Bottom 0.813: 67.56,26.33 v68.2,26.33 | 53.59,27.85 50.16,27.85 v49.15,28.87 | 42.67,30.52 42.61,29.71 v42.55,28.87
  Bottom 1.016: R28.2 4.06,35.85 7.11,32.81 7.11,29.5 9.4,27.22 11.96,27.22 X1.6 12.47,27.22 17.84,27.22 | v28.13,28.93 27.37,28.93 25.91,27.22 17.84,27.22 | Q3.3 22.94,32.37 20.59,29.99 17.84,27.22
GND  (via drill 0.6)
  Top 0.61: X2.1 86.49,6.39 R39.2
  Top 1.016: v25.15,7.15 34.04,7.15
  Top 1.27: v45.09,26.84 35.43,26.84
  Bottom 0.305: 37.21,11.47 37.21,10.96 | 37.21,10.96 37.21,10.45 | 37.21,10.96 37.97,10.96
  Bottom 1.27: 29.34,27.03 37.27,27.03
  other vias: 29.08,7.15 5.97,41.57 17.14,24.8 25.27,13.12 67.44,12.61 76.07,33.95 64.9,20.74 24.64,3.09 48.51,8.17 49.53,25.44 48.39,39.79 84.71,18.2 89.03,35.47
  pour Bottom: 0,50.08 90.3,50.08 90.3,-0.09 0,-0.09
  pour Top: 0,50.08 90.3,50.08 90.3,-0.09 0,-0.09
N$1  (via drill 0.6)  (3 unrouted)
  Top 0.406: v52.96,30.77 51.44,30.77 51.31,30.01 | v2.79,2.33 v2.79,4.87
  Top 0.61: v23.88,19.85 25.91,19.85 27.94,21.88 30.48,24.8 30.86,24.93 46.35,24.93 50.55,27.73
  Top 0.813: 50.55,27.73 51.31,30.01 51.31,32.68 55.82,32.74 TP24.TP 59.87,33.75 2.9
  Bottom 0.406: 52.96,32.28 v52.96,30.77
  Bottom 0.61: 21.84,11.72 23.88,14.52 v23.88,19.85 | D13.1 21.73,3.71 19.81,5.63 16,5.63 15.49,5.12 5.59,5.12 v2.79,2.33 | v2.79,4.87 7.11,9.18 15.49,9.18 16,9.69 21.59,9.69 | 21.59,9.69 21.84,9.69 21.84,7.65 D12.1 | D2.1 21.73,9.83 21.59,9.69
  Bottom 1.016: 59.18,32.74 60.31,32.92 60.35,32.92 2.9
N$2  (via drill 0.6)
  Top 0.406: 28.89,44.82 36.7,44.82 37.72,46.4 39.37,46.4 43.75,43.54 63.63,43.54
  Top 0.61: X1.4 12.26,34.97 14.73,34.97 27.3,44.87 28.89,44.82 | 63.63,43.54 70.68,38.97 72.9,38.97 v75.38,39.41 75.44,39.35 78.99,39.35 80.14,40.49 80.14,45.76 79.18,46.71 76.01,46.71 75.38,47.35 X3.2
  Bottom 0.406: v75.38,39.41 78.87,39.41 80.14,38.77 IC3.10 | X1.4 14.03,34.9 14.99,35.85 | 14.99,35.85 17.27,38.14 18.04,38.14 R31.1 | R24.2 14.99,35.85
N$3  (via drill 0.6)
  Top 0.406: 27.12,48.11 27.37,48.53 38.16,48.53 44.26,44.81 63.31,44.81 | 64.9,45.76 68.39,45.76 69.66,45.12 72.64,42.59 73.79,42.59 75.28,42.21 | v78.23,42.27 77.91,41.95 76.33,41.95 75.28,42.21 | 73.15,46.4 74.74,44.81 74.74,42.75 75.28,42.21
  Top 0.61: X1.3 12.43,39.09 15.68,39.09 26.16,47.16 27.12,48.11 | 63.31,44.81 64.9,45.76 | X3.3 72.83,46.71 73.15,46.4
  Bottom 0.406: IC3.13 79.18,42.59 78.55,42.27 v78.23,42.27 | X1.3 14.63,38.86 15.87,40.04 | 15.87,40.04 R30.1 | R23.2 15.87,40.04
N$4  (1 unrouted)
  Top 0.406: 30.29,21 36.32,21
  Top 0.61: X1.8 20.07,19.09 20.86,18.3 28.1,18.3 30.29,21 | 36.32,21 50.29,21 53.47,24.8 54.74,26.58 54.93,26.65
  Bottom 0.406: 2.7 59.18,27.98 55.88,27.98 54.9,26.75
  Bottom 0.61: TP22.TP 61.22,26.71 2.7 | 54.9,26.75 LED6.A
N$5  (1 unrouted)
  Bottom 0.61: T1.1 79.88,11.85 78.99,10.96 75.69,10.96 74.17,8.93
N$6  (via drill 0.6)
  Top 0.61: v38.1,44.8 41.78,42.84 42.55,42.46 62.61,42.46 74.3,35.35 v81.15,35.35
  Bottom 0.406: v81.15,35.35 81.15,29.73 IC6.16
  Bottom 0.61: v38.1,44.8 29.84,44.8 29.08,44.11 R13.1
N$7  (1 unrouted)
  Bottom 0.406: IC7.11 39.88,10.07 38.99,9.31 38.22,9.06
N$8
  Bottom 1.27: R27.2 R28.1
N$9  (1 unrouted)
  Bottom 0.61: T1.3 79.88,14.9 77.98,12.99
N$10
  Bottom 0.61: 87.38,16.3 87.38,15.03
N$11  (1 unrouted)
  Bottom 0.61: Q1.3 25.53,38.27 25.53,38.39
  Bottom 0.813: 25.53,38.39 25.53,41.94 D15.2
  Bottom 1.27: X1.5 17.82,30.94 25.15,38.27 25.53,38.27
N$12  (2 unrouted)
  Top 0.711: 21.08,5.2 36.45,5.2
  Top 0.813: X1.12 16,3.21 21.08,5.2 | 36.45,5.2 47.75,5.2 49.15,4.36 50.8,4.36 53.72,7.66 56.77,7.66 LED1.K 2.2
  Bottom 0.61: TP16.TP 2.2 | 17.25,3.21 12.7,3.21
N$13  (2 unrouted)
  Top 0.406: 57.36,13.93 56.9,14.11 53.34,14.11 52.07,14.9
  Top 0.61: 57.36,12.74 57.36,13.93 | 52.07,14.9 44.26,14.9 36.91,9.17
  Top 0.711: 36.91,9.17 24.52,9.17
  Top 0.813: 2.3 57.36,12.74 | 24.52,9.17 15.85,7.18 X1.11
  Bottom 0.61: TP17.TP 2.3 | 17.28,7.18 X1.11
N$14  (2 unrouted)
  Top 0.406: 52.45,16.3 53.85,14.92 57.02,14.92 57.34,16.23
  Top 0.61: 38.23,13.11 43.94,16.3 52.45,16.3
  Top 0.711: 30.92,13.11 38.23,13.11
  Top 0.813: X1.10 12.21,11.15 29.65,11.15 30.92,13.11 | 57.34,16.23 64.6,16.25 2.4
  Bottom 0.61: TP18.TP 66.69,16.23 2.4 | 17.06,11.15 12.7,11.15 12.69,11.14 X1.10
N$15  (via drill 0.6)
  Top 0.711: 38.61,32.91 31.05,32.91
  Top 0.813: IC4.1 40.13,32.93 38.61,32.91
  Top 1.016: 31.05,32.91 28.8,32.91 25.4,29.25 25.4,24.54 | 25.4,24.54 23.78,22.92 12.29,22.92 X1.7 | 25.4,24.54 25.4,23.15 v24.89,22.65
  Bottom 0.61: R18.1 42.01,36.77 IC4.1 | v24.89,22.65 26.29,22.65 R5.2
N$16  (via drill 0.6)
  Top 0.406: v39.88,19.34 v37.72,19.34
  Bottom 0.406: 43.43,7.66 43.43,6.39 IC7.8 | 43.43,7.66 IC7.6 | 43.43,7.66 43.43,8.93 43.16,9.31 43.16,14.77 41.4,16.42 41.27,16.55 39.88,17.69 v39.88,19.34 | v37.72,19.34 37.34,18.71 36.91,18 35.96,17.06 29.34,17.06 | 29.34,17.06 R5.1 | 27.43,16.68 28.96,16.68 29.34,17.06
N$17  (via drill 0.6)  (1 unrouted)
  Top 0.406: 25.02,49.06 25.27,49.29 39.31,49.29 44.32,46.08 62.36,46.08 | v73.47,44.17 69.98,46.71 63.31,46.71
  Top 0.61: X1.2 12.28,42.9 15.37,42.9 24.77,48.81 25.02,49.06 | 62.36,46.08 63.31,46.71 | X3.4 69.98,48.94 69.98,46.71
  Bottom 0.406: IC3.12 79.18,41.31 78.55,41 76.96,41 74.1,42.59 v73.47,44.17 | 12.11,42.9 14.93,42.9 16.29,44.2 | 16.29,44.2 17.02,46.01 R29.1 | R22.2 16.29,44.2
N$18
  Bottom 0.406: IC3.15 83.31,45.12 84.2,44.11 84.2,34.84 84.96,34.08 84.96,24.8 86.11,23.28 IC6.5
N$19  (2 unrouted)
  Top 0.61: 57.53,41.06 59.5,38.77 60.77,38.77 61.4,38.14 61.91,37.76 64.71,34.9 64.71,31.54 | 65.68,30.52 2.8
  Top 0.813: X1.14 37.99,42.82 39.75,41.06 57.53,41.06 | 64.71,31.54 65.68,30.52
  Bottom 0.406: 63.8,30.69 63.46,31.2 57.34,31.16
  Bottom 0.61: LED7.K 57.28,32.19
  Bottom 1.016: 2.8 TP23.TP 63.8,30.69
N$20  (via drill 0.81)  (1 unrouted)
  Top 0.813: X1.17 36.16,30.81 36.96,30.65 48.13,30.65 49.28,32.3 49.28,34.2 50.29,34.97 v52.83,34.97
  Bottom 0.813: v52.83,34.97 52.83,36.73
  Bottom 1.016: 1.9 69.6,33.75 TP9.TP 65.35,34.19 63.63,35.6 59.18,35.6 58.29,34.97 v52.83,34.97
N$21  (via drill 0.6)  (1 unrouted)
  Top 0.61: X1.19 49.08,23.02 | 49.09,23.03 53.02,27.09 v53.02,29.31
  Bottom 0.61: v53.02,29.31 51.24,29.31 50.55,29.88 50.61,40.05 D11.1
  Bottom 0.813: 55.31,43.6 52.79,42.04 D11.1
  Bottom 1.016: 55.31,43.6 62.04,43.6 64.58,41 TP11.TP 69.34,40.68 71.21,40.68 1.11
N$22
  Bottom 0.813: D10.2 57.57,38.77 D11.2
  Bottom 1.016: 1.10 TP10.TP 72.39,36.62 71,38.01 69.02,39.09 64.26,39.09 63.94,38.77 57.57,38.77
N$23
  Bottom 0.406: R1.2 30.48,10.9 30.48,10.96
  Bottom 0.61: 30.48,10.96 33.9,10.96 X1.22
N$24
  Bottom 0.406: IC7.10 40.13,8.93 38.73,7.28 36.58,5.25 C8.1 R1.1
N$25
  Bottom 0.406: IC6.13 78.36,24.55
  Bottom 0.61: TP6.TP 77.44,23.22 1.6 78.36,24.55
N$26
  Bottom 0.406: 75.19,26.75 1.7 | IC6.14 76.93,25.82
  Bottom 0.61: TP7.TP 71.88,26.84 1.7 | 76.93,25.82 75.19,26.75
N$27  (via drill 0.6)  (1 unrouted)
  Top 0.406: 67.44,33.44 66.55,34.33 63.88,37.12 63.37,38.39 | 57.34,18.14 56.52,17.59 53.85,17.59 53.34,17.31 | v38.23,16.3 39,16.55 38.98,16.56
  Top 0.508: 67.44,33.44 68.2,32.3 | 63.12,18.14 57.34,18.14 | 53.34,17.31 42.93,17.31 38.98,16.56
  Top 0.61: 63.12,18.14 65.15,19.28 68.33,21.12 69.22,22.01 69.22,24.17 66.68,25.82 66.68,27.34 68.71,28.36 69.34,29.38 69.34,31.16 68.2,32.3 v66.29,32.42 | 2.11 61.18,40.59 63.37,38.39
  Bottom 0.406: TP26.TP 69.34,31.66 67.82,32.17 | R3.1 v38.23,16.3
  Bottom 0.61: 67.76,32.17 v66.29,32.42
N$28
  Bottom 0.61: J1.1 64.14,46.79 2.12
N$29
  Bottom 0.61: IC4.2 44.58,37.15 R18.2
N$30  (2 unrouted)
  Bottom 0.406: R7.1 R25.2 42.04,3.47 | 42.04,3.98 C5.1 38.86,3.6 R8.2 | IC7.9 40.01,7.53 39.5,6.9 39.5,3.85
N$31
  Bottom 0.406: R9.2 38.73,21.38 38.73,17.31 40.51,15.53 40.51,14.08 IC7.14
N$32
  Bottom 0.406: 49.53,10.2 49.53,9.44
N$33
  Bottom 0.406: 46.05,18.96 46.69,18.96
N$34
  Bottom 0.61: LED6.K 59.03,25.35 R4.1
N$35
  Bottom 0.61: 47.12,30.27 Q2.3
  Bottom 0.813: IC4.3 47.12,30.27
N$36
  Bottom 0.406: R9.1 39.62,25.44 | 43.18,27.22 Q2.1
  Bottom 0.61: 43.18,27.22 40.01,27.22 C7.2 39.62,25.44
N$37  (via drill 0.6)
  Top 0.406: 85.34,46.52 85.85,46.01 85.85,33.06 85.6,32.81 85.6,31.28 86.36,30.52 86.36,22.39 85.22,21.25 v84.84,21.25
  Top 0.61: v84.84,47.03 85.34,46.52
  Bottom 0.406: IC3.2 86.17,45.12 v84.84,47.03 | IC6.7 85.34,20.74 v84.84,21.25
N$38
  Bottom 0.406: 1.3 72.01,12.75 73.03,13.26 73.03,17.06 74.42,18.45 74.8,18.45 75.95,19.6 78.11,19.6 80.26,22.01 IC6.11
  Bottom 0.61: TP3.TP 72.2,12.52 1.3
N$39
  Bottom 0.406: 1.5 74.57,19.75 75.69,20.87 77.98,20.87 79.25,22.14 79.88,22.9 80.26,23.28 IC6.12
  Bottom 0.61: 1.5 71.97,21.4 TP5.TP
N$41
  Top 0.508: 58.8,25.57 58.8,27.6
  Top 0.61: LED1.A LED2.A | LED4.A LED5.A 56.77,24.68 58.29,25.19 58.8,25.57 | 58.8,27.6 57.91,28.74 56.37,28.74 LED7.A
  Bottom 0.61: LED1.A 54.86,8.93 54.36,8.42 52.77,8.42 R11.1 | LED2.A LED3.A LED4.A
N$42
  Bottom 0.61: X1.16 36.89,34.9 38.86,36.87 38.86,38.77 40.26,40.17 45.72,40.17 ZüNDSPULE.TP
N$43
  Bottom 0.406: R14.2 26.04,29.63 27.69,31.28 27.69,32.22 Q3.1
  Bottom 0.61: Q3.1 27.76,34.41 | 27.76,34.41 29.08,39.28 R13.2 | Q1.1 27.71,34.46 27.76,34.41
N$44
  Bottom 0.406: IC6.2 IC6.1 88.01,29.02 88.01,32.55 85.09,35.35 85.09,42.97 85.98,43.85 IC3.3
N$45
  Bottom 0.406: R12.2 R10.1 46.79,20.08 C2.1
N$46
  Bottom 0.406: IC7.5 44.94,8.93 43.94,10.18 43.94,15.28 42.42,17.82 R12.1 41.91,21.4 C3.1
N$47
  Bottom 0.406: IC7.4 R15.1 50.93,10.45 51.05,12.36 51.82,12.87 R16.2 R17.2
N$48
  Bottom 0.406: IC7.13 39.82,12.74 38.73,13.12 R3.2 37.53,13.57 35.05,14.52 34.48,14.52 X1.21
N$49
  Bottom 0.406: R17.1 52.2,17.82 52.2,20.03 D8.1
N$50  (via drill 0.6)
  Top 0.406: v86.61,31.92 86.67,31.66 86.73,31.97
  Top 0.61: 86.73,31.97 86.74,33.63 86.74,47.79 v87.12,48.3
  Bottom 0.406: IC6.4 86.3,24.55 85.85,25.19 85.85,31.09 v86.61,31.92
  Bottom 0.61: v87.12,48.3 87.12,46.4 IC3.1
N$51  (2 unrouted)
N$52
  Bottom 0.406: 77.52,30.2 1.8 78.35,27.09 IC6.15
  Bottom 0.61: TP8.TP 77.43,30.2 1.8
N$53  (via drill 0.6)
  Top 0.813: X1.15 37.59,38.46 55.92,38.46 59.18,37.19 v59.82,37.19
  Bottom 0.61: TP25.TP 66.62,37.19
  Bottom 0.813: v59.82,37.19 66.62,37.19 2.10
N$54  (1 unrouted)
  Bottom 0.711: 15.24,17.06 7.81,17.06
  Bottom 1.016: 21.73,16.66 20.57,17.82 16,17.82 15.24,17.06
  Bottom 1.27: 7.81,17.06 4.06,14.52 R27.1
N$55  (1 unrouted)
  Top 0.406: LED4.K 56.2,18.43 53.98,18.43 53.59,18.71 | 36.48,17.03 30.45,17.03 30.23,17.06
  Top 0.61: 2.5 LED4.K | 53.59,18.71 43.33,18.71 40.13,17.95 38.35,17.95 36.67,17.03 36.48,17.03 | X1.9 12.33,14.96 16,14.96 20.83,17.06 30.23,17.06
  Bottom 0.61: TP19.TP 58.55,18.86 59.44,19.75 2.5 | 17.07,15.1 X1.9
N$56  (1 unrouted)
  Bottom 0.406: IC3.14 82.68,43.85 83.31,43.22 83.31,34.33 84.07,33.44 84.07,24.3 85.98,22.01 87.76,22.01
N$57  (via drill 0.6)  (1 unrouted)
  Top 0.61: X2.2 v84.9,9.25 86.49,9.25
  Bottom 0.406: v84.9,9.25 89.15,9.25 89.15,14.77 88.77,14.9
  Bottom 0.61: T1.2 83.57,13.38 85.09,14.9 | T1.4 83.82,16.42 85.09,14.9 | X2.2 84.58,8.93 | 84.58,8.93 v84.9,9.25 | 84.58,8.93 86.43,8.93 R38.1 | 85.09,14.9 T1.6 88.77,14.9
N$58
  Top 0.61: X1.24 30.87,3.22 TACHO_BEL.TP
N$59
  Bottom 0.61: TP2.TP 78.11,8.42 78.11,9.05 1.2 79.5,9.44 81.28,10.45 83.06,10.45 84.33,11.72 87.63,11.72 87.5,11.85 | T1.8 87.5,11.85 | 87.5,13.25 87.5,11.85
N$60
  Top 0.61: 2.6 LED5.K
  Bottom 0.406: IC7.2 47.75,12.74 48.51,13.63 48.51,14.39 50.29,16.17 50.29,22.39 51.13,23.48 D8.2 53.8,21.88 56.9,21.88 57.4,22.39
  Bottom 0.61: TP21.TP 66.71,23.22 2.6 | LED5.K 57.4,22.39
N$61  (1 unrouted)
  Bottom 0.305: 87.63,25.82 89.28,25.82 89.28,29.25 88.9,29.76
  Bottom 0.406: 88.9,29.76 88.9,31.54 88.9,32.81 85.93,35.79 85.93,40.05 IC3.6
N$62
  Bottom 0.406: 44.12,18.96 43.48,18.96
N$63
  Bottom 1.422: 28.07,28.87 29.59,28.87
N$64
  Bottom 0.406: 49.07,18.96 48.44,18.96
N$65
  Bottom 0.406: 41.1,18.96 41.73,18.96
N$66
  Bottom 0.406: 44.12,18.96 43.48,18.96
N$67
  Bottom 0.406: IC6.10 80.26,20.74 79.25,19.47 79.25,18.03 1.4
  Bottom 0.61: TP4.TP 77.46,16.23 1.4
N$68
  Bottom 0.406: 46.05,18.96 46.69,18.96
N$69
  Top 0.813: 40.77,2.01 59.69,1.88
  Top 1.016: X1.1 9.91,46.71 8.45,44.87 8.45,1.75 9.91,0.93 37.78,0.93 40.77,2.01 | 59.69,1.88 61.91,3.53 66.57,3.53 1.1
  Bottom 0.61: TP1.TP 1.1
N$70
  Top 0.813: 69.09,26.71 69.09,26.2
N$75
  Bottom 0.406: 46.05,18.96 46.69,18.96
N$83
  Bottom 0.406: R7.2 45.59,2.2 | IC7.7 46.03,6.26 45.47,4.36 45.47,4.23 45.59,3.34 R25.1
  Bottom 0.61: R6.1 45.47,3.34 45.47,4.23 | C6.1 45.85,1.95 45.59,2.2
  Bottom 0.813: 45.59,2.2 45.59,3.34
N$580  (1 unrouted)
  Bottom 0.406: 46.1,14.01 47.12,15.03 47.12,16.23 R19.2 48.38,17.95 R10.2
VCC  (via drill 0.6)  (2 unrouted)
  Top 0.61: v49.91,7.03 v49.91,13.63
  Bottom 0.406: R19.1 44.89,16.23 44.73,15.15 44.73,11.98 44.96,11.47 IC7.3 48.77,11.47 49.28,11.98 49.34,11.98 R15.2
  Bottom 0.61: v49.91,13.63 R15.2 | 54.23,5.88 50.8,5.88 | R6.2 49.15,5.5 | 52.58,4.68 R11.2 | C4.1 56.64,6.14
  Bottom 0.813: 54.23,5.88 54.48,6.14 IC1.OUT 56.64,6.14 | 50.8,5.88 49.78,5.88 | 49.78,5.88 v49.91,7.03 | 49.15,5.5 49.78,5.88
(copper drawn outside any net)
  shapes: Bottom area x6

### Text on the board
Top: top | BEP V2.1 / maru-labs.com
tPlace: QC
bPlace: 5 | 4 | 3 | 1 | 2
tNames: Zünd | GND c b a 12V(rt) | 18 | 19 < | 2.7 / 2.6 | Bulb Test / cut here | 1.12 GND / 1.11 < / 1.10 <> / 1.9 > / 1.8 N / 1.7 G1 / 1.6 G2 / 1.5 G3 / 1.4 G4 / 1.3 G5 | 1.2 CC | GND / REV / HiB / WL / BT / ABS / FUL / ALT / TMP / OIL / CHK / IGN | 1.1 STBY | 1 STBY / 2 GC / 3 GB / 4 GA / 5 START / 6 ZP+ / 7 FUL / 8 ABS / 9 ALT / 10 TMP / OIL / CHK | 2.12 / 2.11 / 2.1 / 2.9 / / / / 2.5 / 2.4 / 2.3 / 2.2 / 2.1 | Choke / cut here | 13 GND / 14 BT / 15 HiB / 16 Zünd / 17 > / / / / 21 Rev in / 22 REV out / 23 / 24
bNames: N
tStop: BEP V2.1 / maru-labs.com
tDocu: +12v